# EAGLE design String Shooter (EAGLE 9.6.2)
REVISION: 1.0; SCH_DESC: An Example Schematic; TEAM: Example_Team_Number
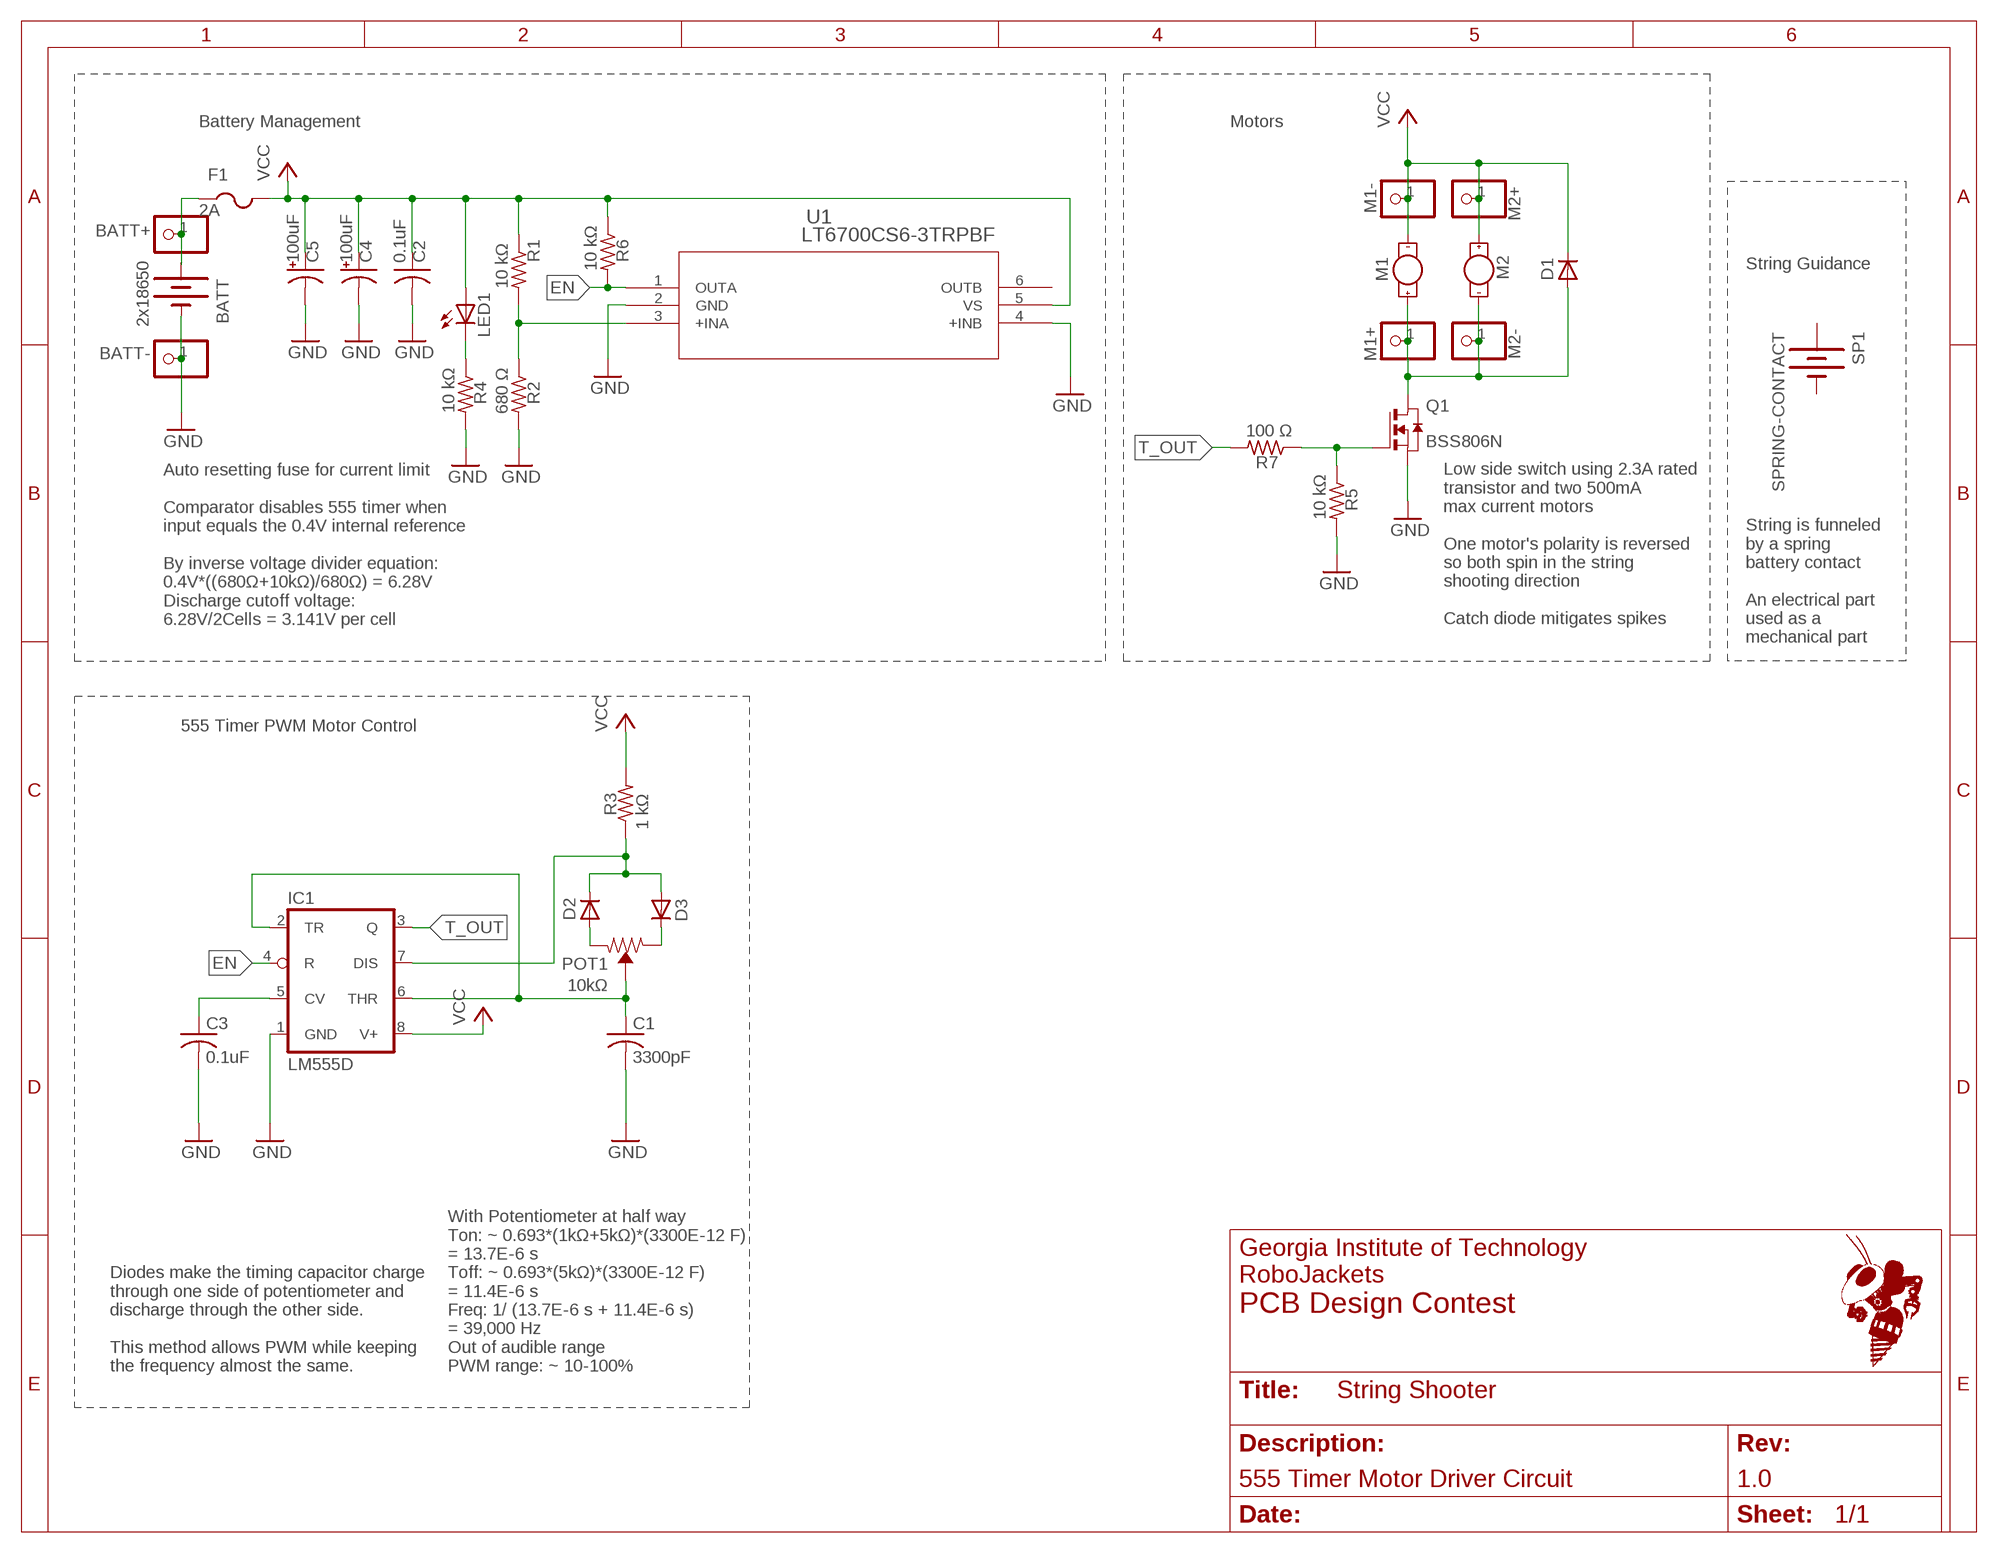
[diagram p0: schematic, sheet 1]
FRAME2 (FRAME_A_L): REVISION: 1.0; SCH_DESC: 555 Timer Motor Driver Circuit; TEAM: PCB Design Contest

## Parts
BATT  2x18650  BATTERY-DEVICE  [BATTERY-CASE]
BATT+  PINHD-1X1CB  [1X01-CLEANBIG]
BATT-  PINHD-1X1CB  [1X01-CLEANBIG]
C1  3300pF  C-USC0603  [C0603]
C2  0.1uF  C-USC0603  [C0603]
C3  0.1uF  C-USC0603  [C0603]
C4  100uF  CPOL-USE22-6AXIAL  [E22-6]
C5  100uF  CPOL-USE22-6AXIAL  [E22-6]
D1  DIODE-DO-214AC  [DO-214AC]
D2  DIODE-DO-214AC  [DO-214AC]
D3  DIODE-DO-214AC  [DO-214AC]
F1  2A  PTCFUSE-1206  [R1206]
IC1  LM555D  [SO08]
LED1  LEDCHIP-LED0603  [CHIP-LED0603]
M1  LITTLE-MOTOR  [DC_MOTOR]
M1+  PINHD-1X1CB  [1X01-CLEANBIG]
M1-  PINHD-1X1CB  [1X01-CLEANBIG]
M2  LITTLE-MOTOR  [DC_MOTOR]
M2+  PINHD-1X1CB  [1X01-CLEANBIG]
M2-  PINHD-1X1CB  [1X01-CLEANBIG]
POT1  10kΩ  THUMBPOT  [THUMBWHEEL-POT]
Q1  BSS806N  [SOT-23-3]
R1  10 kΩ  R-US_R0603  [R0603]
R2  680 Ω  R-US_R0603  [R0603]
R3  1 kΩ  R-US_R0603  [R0603]
R4  10 kΩ  R-US_R0603  [R0603]
R5  10 kΩ  R-US_R0603  [R0603]
R6  10 kΩ  R-US_R0603  [R0603]
R7  100 Ω  R-US_R0603  [R0603]
SP1  SPRING-CONTACT  [SPRING-CONTACT]
U1  LT6700CS6-3TRPBF  [TSOT-23_S6]

## Nets
EN: IC1.4(R) R6.2 U1.1(OUTA)
GND: BATT-.1 C1.2 C2.2 C3.2 C4.- C5.- IC1.1(GND) Q1.2(S) R2.2 R4.2 R5.2 U1.2(GND) U1.4(+INB)
N$1: D2.A POT1.P$1(CCW)
N$2: D1.A M1+.1 M2-.1 Q1.3(D)
N$3: C3.1 IC1.5(CV)
N$10: D3.C POT1.P$3(CW)
N$11: D2.C D3.A IC1.7(DIS) R3.1
N$12: Q1.1(G) R5.1 R7.1
N$13: R1.2 R2.1 U1.3(+INA)
N$14: LED1.C R4.1
N$15: BATT+.1 F1.1
T_OUT: IC1.3(Q) R7.2
THR: C1.1 IC1.2(TR) IC1.6(THR) POT1.P$2(WIPER)
VCC: C2.1 C4.+ C5.+ D1.C F1.2 IC1.8(V+) LED1.A M1-.1 M2+.1 R1.1 R3.2 R6.1 U1.5(VS)
Unconnected: U1.6(OUTB)

## Notes on the sheet
- Battery Management | Motors
- String Guidance
- Auto resetting fuse for current limit
  
  Comparator disables 555 timer when
  input equals the 0.4V internal reference
  
  By inverse voltage divider equation:
  0.4V*((680Ω+10kΩ)/680Ω) = 6.28V
  Discharge cutoff voltage:
  6.28V/2Cells = 3.141V per cell
- Low side switch using 2.3A rated
  transistor and two 500mA
  max current motors
  
  One motor's polarity is reversed
  so both spin in the string
  shooting direction
  
  Catch diode mitigates spikes
- String is funneled
  by a spring 
  battery contact
  
  An electrical part 
  used as a 
  mechanical part
- 555 Timer PWM Motor Control
- Diodes make the timing capacitor charge
  through one side of potentiometer and
  discharge through the other side.
  
  This method allows PWM while keeping
  the frequency almost the same.
- With Potentiometer at half way
  Ton: ~ 0.693*(1kΩ+5kΩ)*(3300E-12 F)
  = 13.7E-6 s
  Toff: ~ 0.693*(5kΩ)*(3300E-12 F)
  = 11.4E-6 s
  Freq: 1/ (13.7E-6 s + 11.4E-6 s)
  = 39,000 Hz
  Out of audible range
  PWM range: ~ 10-100%

## Library data of the parts
BATT = battery-stringshooter-holder-18650:BATTERY-DEVICE
BATT+ BATT- M1+ M1- M2+ M2- = adafruit:PINHD-1X1: Pin header 1x1 for 0.1" spacing With round pins
C1-C3 = rcl:C-US: CAPACITOR, American symbol; SPICEPREFIX: C
C4 C5 = resistor:CPOL-US: POLARIZED CAPACITOR, American symbol
D1-D3 = RoboJackets-Diodes:DIODE-: DIODE
F1 = adafruit:PTCFUSE: PTC fuses, resettable thermistors
IC1 = adafruit:*555: TIMER Changed DIP package to have round (not oval) pin pads http://www.ladyada.net/library/pcb/eaglelibrary.html
LED1 = adafruit:LED: LED OSRAM: - CHIPLED LG R971, LG N971, LY N971, LG Q971, LY Q971, LO R971, LY R971 LH N974, LH R974 LS Q976, LO Q976, LY Q976 LO Q996 - Hyper CHIPLED LW Q18S LB Q993, LB Q99A, LB R99A - SideLED LS A670, LO A670, LY A670, LG A670, LP A670 LB A673, LV A673, LT A673, LW A673 LH A674 LY A675 LS A676, LA A676, LO A676, LY A676, LW A676 LS A679, LY A679, LG A679 - Hyper Micro SIDELED® LS Y876, LA Y876, LO Y876, LY Y876 LT Y87S - SmartLED LW L88C, LW L88S LB L89C, LB L89S, LG L890 LS L89K, LO L89K, LY L89K LS L896, LA L896, LO L896, LY L896 - TOPLED LS T670, LO T670, LY T670, LG T670, LP T670 LSG T670, LSP T670, LSY T670, LOP T670, LYG T670 LG T671, LOG T671, LSG T671 LB T673, LV T673, LT T673, LW T673 LH T674 LS T676, LA T676, LO T676, LY T676, LB T676, LH T676, LSB T676, LW T676 LB T67C, LV T67C, LT T67C, LS T67K, LO T67K, LY T67K, LW E67C LS E67B, LA E67B, LO E67B, LY E67B, LB E67C, LV E67C, LT E67C LW T67C LS T679, LY T679, LG T679 LS T770, LO T770, LY T770, LG T770, LP T770 LB T773, LV T773, LT T773, LW T773 LH T774 LS E675, LA E675, LY E675, LS T675 LS T776, LA T776, LO T776, LY T776, LB T776 LHGB T686 LT T68C, LB T68C - Hyper Mini TOPLED® LB M676 - Mini TOPLED Santana® LG M470 LS M47K, LO M47K, LY M47K Source: http://www.osram.convergy.de/
M1 M2 = motor-stringshooter:LITTLE-MOTOR
POT1 = Potentiometer_Thumbwheel:THUMBPOT
Q1 = RoboJackets-Discrete:BSS806N; DKPN: BSS806NH6327XTSA1CT-ND
R1-R7 = rcl:R-US_: RESISTOR, American symbol; SPICEPREFIX: R
SP1 = battery-contact-AA:SPRING-CONTACT
U1 = LT6700CS6-3TRPBF:LT6700CS6-3TRPBF; DESCRIPTION: Comparator Dual 18V Automotive 6-Pin TSOT-23 T/R; DIGI-KEY_PART_NUMBER: LT6700CS6-3#TRPBFCT-ND; MF: Analog Devices; MP: LT6700CS6-3#TRPBF; PACKAGE: SOT-6 Analog Devices

## Board
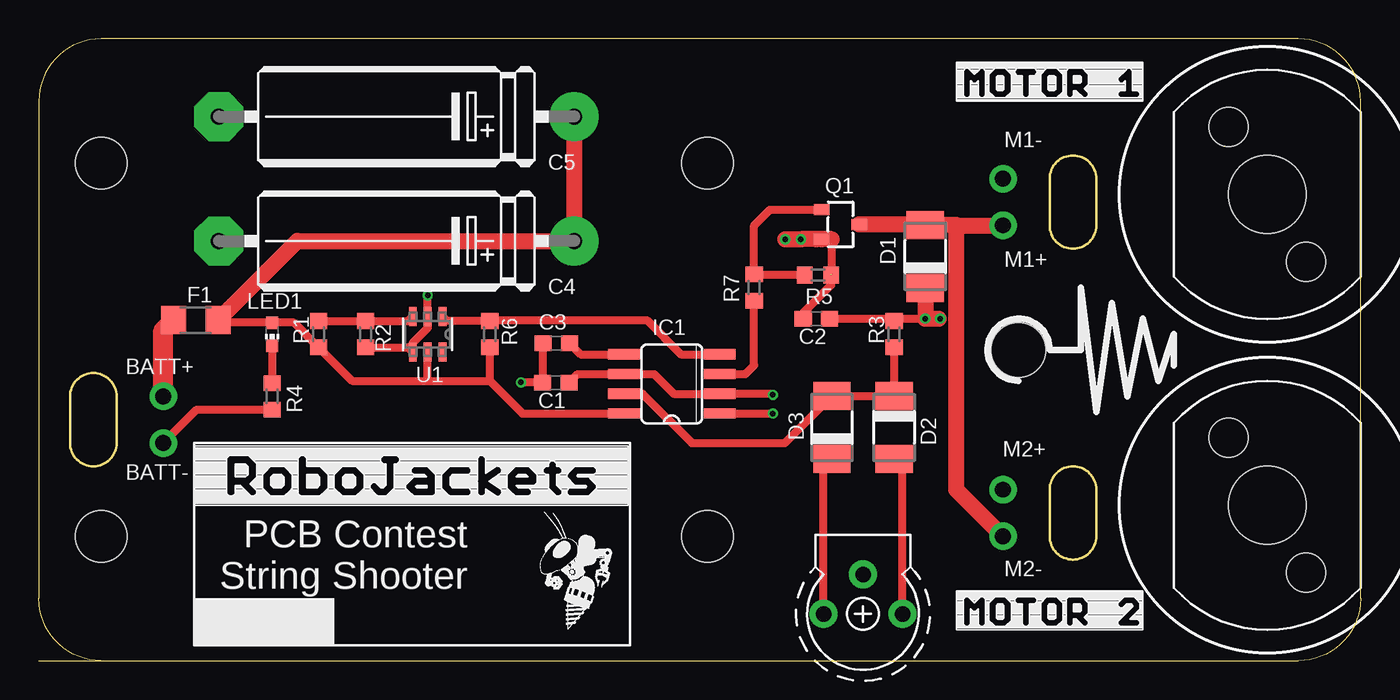
[diagram p1: board, top side]
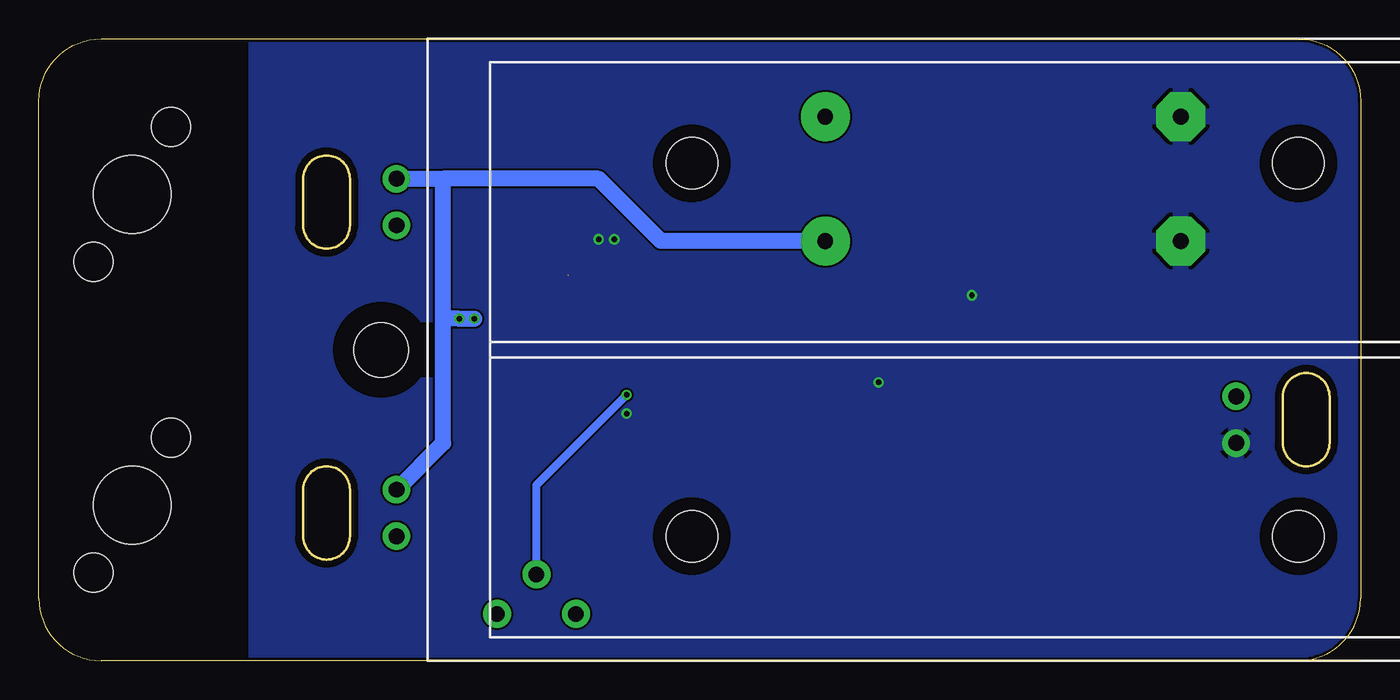
[diagram p2: board, bottom side, seen from below]

Size 85 x 40 mm. Coordinates in mm from the lower left corner, seen from the top.
Outline: 0,0 4,0
Outline: 4,0 81,0 arc90 85,4 85,36 arc90 81,40 4,40 arc90 0,36 0,4 arc90 4,0
Outline: 65,11 arc-180 68,11 68,8 arc-180 65,8 65,11
Outline: 65,31 arc-180 68,31 68,28 arc-180 65,28 65,31
Outline: 2,17 arc-180 5,17 5,14 arc-180 2,14 2,17
Copper layers (1*16): Top 0.035mm / dielectric 1.53mm / Bottom 0.035mm
Design rules "JLCPCB (2 Layer)": minimum track width 5mil, minimum drill 0.3mm, track to track 5mil, track to pad 5mil, pad to pad 5mil, via to via 20mil, smd to smd 5mil, copper to edge 0.2mm, drill to drill 21mil, minimum pad ring 6mil, minimum via ring 6mil, stop-mask expansion 0.05mm, vias tented up to drill 30mil, thermal gap 10mil
bRestrict: area 1.8,29.8 to 6.2,34.2; area 1.8,5.8 to 6.2,10.2; area 40.8,29.8 to 45.2,34.2; area 60.2,17.2 to 65.8,22.8; area 40.8,5.8 to 45.2,10.2; 12 lines

### Footprints (pad centres in the part's own frame; a part is rotated, then mirrored left to right if it is on the bottom)
BATTERY-CASE = hole 3.3: 17,32; 56,32; 17,8; 56,8
1X01-CLEANBIG = drill 1.016 pad 1.778: 1 0,0
C0603 = smd 1.1 x 1: 1 -0.85,0; 2 0.85,0
E22-6 = drill 1.016 pad 3.15: + -11.43,0 | drill 1.016 pad 3.15 octagon: - 11.43,0
DO-214AC = smd 1.8 x 2.4: A 2.025,0; C -2.025,0
R1206 = smd 1.6 x 1.803: 1 -1.422,0; 2 1.422,0
SO08 = smd 0.66 x 2.032: 1 -1.905,-3.073; 2 -0.635,-3.073; 3 0.635,-3.073; 4 1.905,-3.073; 5 1.905,3.073; 6 0.635,3.073; 7 -0.635,3.073; 8 -1.905,3.073
CHIP-LED0603 = smd 0.8 x 0.8: A 0,-0.75; C 0,0.75
DC_MOTOR = hole 2.5: 3.5,12.33; 8.5,3.66 | hole 5: 6,8
THUMBWHEEL-POT = drill 1 pad 1.8: P$1 -2.54,0; P$2 0,-2.54; P$3 2.54,0
SOT-23-3 = smd 0.7 x 1: 1 -0.95,-1.2; 2 0.95,-1.2; 3 0,1.2
R0603 = smd 1 x 1.1: 1 -0.85,0; 2 0.85,0
SPRING-CONTACT = hole 3.5: 4,5
TSOT-23_S6 = smd 1.219 x 0.508: 1 -1.143,0.95; 2 -1.143,0; 3 -1.143,-0.95; 4 1.143,-0.95; 5 1.143,0; 6 1.143,0.95

### Placement (x,y rotation side)
BATT  60,0 0 bottom
BATT+  8,17 0 top
BATT-  8,14 0 top
C1  33.24,17.88 180 top
C2  50,22 180 top
C3  33.27,20.43 180 top
C4  23,27 180 top
C5  23,35 180 top
D1  57,26 90 top
D2  55,15 270 top
D3  51,15 90 top
F1  10.1,21.9 0 top
IC1  40.7,17.8 90 top
LED1  15,21 180 top
M1  73,2 0 top
M1+  62,28 0 top
M1-  62,31 0 top
M2  73,22 0 top
M2+  62,11 0 top
M2-  62,8 0 top
POT1  53,3 180 top
Q1  51.55,28.06 270 top
R1  18,21 90 top
R2  21,21 270 top
R3  55,21 90 top
R4  15,17 270 top
R5  50.1,24.8 0 top
R6  29,21 90 top
R7  46,24 270 top
SP1  59,15 0 top
U1  25,21 270 top
U$1  [MOTOR-1]  59,36 0 top
U$2  [MOTOR-2]  59,2 0 top
U$3  [ROBOBUZZ_0.4X]  34,2 0 top
U$4  [ROBOJACKETS]  10,10 0 top

### Tracks (layer width: path | path; a pad name or v marks a point on that pad's centre or on a via)
EN
  Top 0.508: U1.1 26.24,21.85 R6.2 29.05,21.9 39.1,21.9 41.29,19.71 IC1.4
GND  (via drill 0.35)  (1 unrouted)
  Top 0.508: IC1.1 v47.2,15.9 | 24.05,20.31 U1.4 | U1.4 24.05,20.45 25,21.4 U1.2 v25,23.5 | R2.2 23.76,20.15 U1.4 | 51,24.85 51,27.11 | BATT-.1 10.15,16.15 R4.2 | C3.2 32.42,17.91 C1.2 31.02,17.88 v31,17.9 | R5.2 50.95,24.15 49.15,22.35 C2.2
  Top 1.016: 51,27.11 Q1.2 50,27.11 v49.01,27.11 v49,27.1 v48,27.1
  pour Bottom: 0,40 0,0 71,0 71,40
N$1
  Top 0.508: POT1.P$1 55.54,12.44 D2.A
N$2
  Top 1.016: 59,28 59,11 M2-.1 | 59,28 M1+.1 | 59,28 58.97,28.02 D1.A 56.97,28.06 Q1.3
N$3
  Top 0.508: C3.1 34.84,19.71 IC1.5
N$10
  Top 0.508: POT1.P$3 50.46,12.44 D3.C
N$11
  Top 0.508: IC1.7 38.83,17.17 42,14 47.97,14 D3.A D2.C R3.1
N$12
  Top 0.508: Q1.1 47.01,29.01 46,28 R7.1 | R7.1 46.05,24.8 | R5.1 46.05,24.8 | 46.05,24.8 R7.1
N$13
  Top 0.508: R1.2 R2.1 23.76,21.85 U1.3
N$14
  Top 0.508: LED1.C R4.1
N$15
  Top 1.27: BATT+.1 8,21.22 F1.1
T_OUT
  Top 0.508: IC1.3 45.44,18.44 46,19 R7.2
THR  (via drill 0.35)
  Top 0.508: C1.1 34.65,18.44 IC1.6 39.56,18.44 40.83,17.17 IC1.2 47.13,17.17 v47.2,17.1
  Bottom 0.508: POT1.P$2 53,11.3 v47.2,17.1
VCC  (via drill 0.35)
  Top 0.508: LED1.A 15.1,21.85 | IC1.8 31.1,15.9 29,18 | 25,18 20.15,18 R1.1 16.4,21.75 LED1.A | 25,18 29,18 | 29,18 R6.1 | 25,18 U1.5 | C2.1 54.85,22 R3.2 55.15,22 v57,22 v57.96,22 | LED1.A 14.95,21.8 | LED1.A 11.67,21.75 F1.2
  Top 1.016: D1.C v57,22 57.86,22 | F1.2 16.62,27 C4.+ C5.+
  Bottom 1.016: 59,22 59,14 M2+.1 | 59,22 59,31 | M1-.1 59,31 | 59,31 49,31 45,27 C4.+ | 59,22 v57.96,22 v57,22

### Text on the board
tPlace: PCB Contest / String Shooter